# Altium schematic sheet WL-CPU-V1.0.SchDoc
size 594 x 420 mm; Address1: Address1; Address2: Address2; Address3: Address3; Address4: Address4; DocumentNumber: Wolf-Lite; SheetNumber: 2; Scale: 1:1; DocumentType: Схема электрическая принципиальная; FirstReferrence: UA3REO/R7KBI
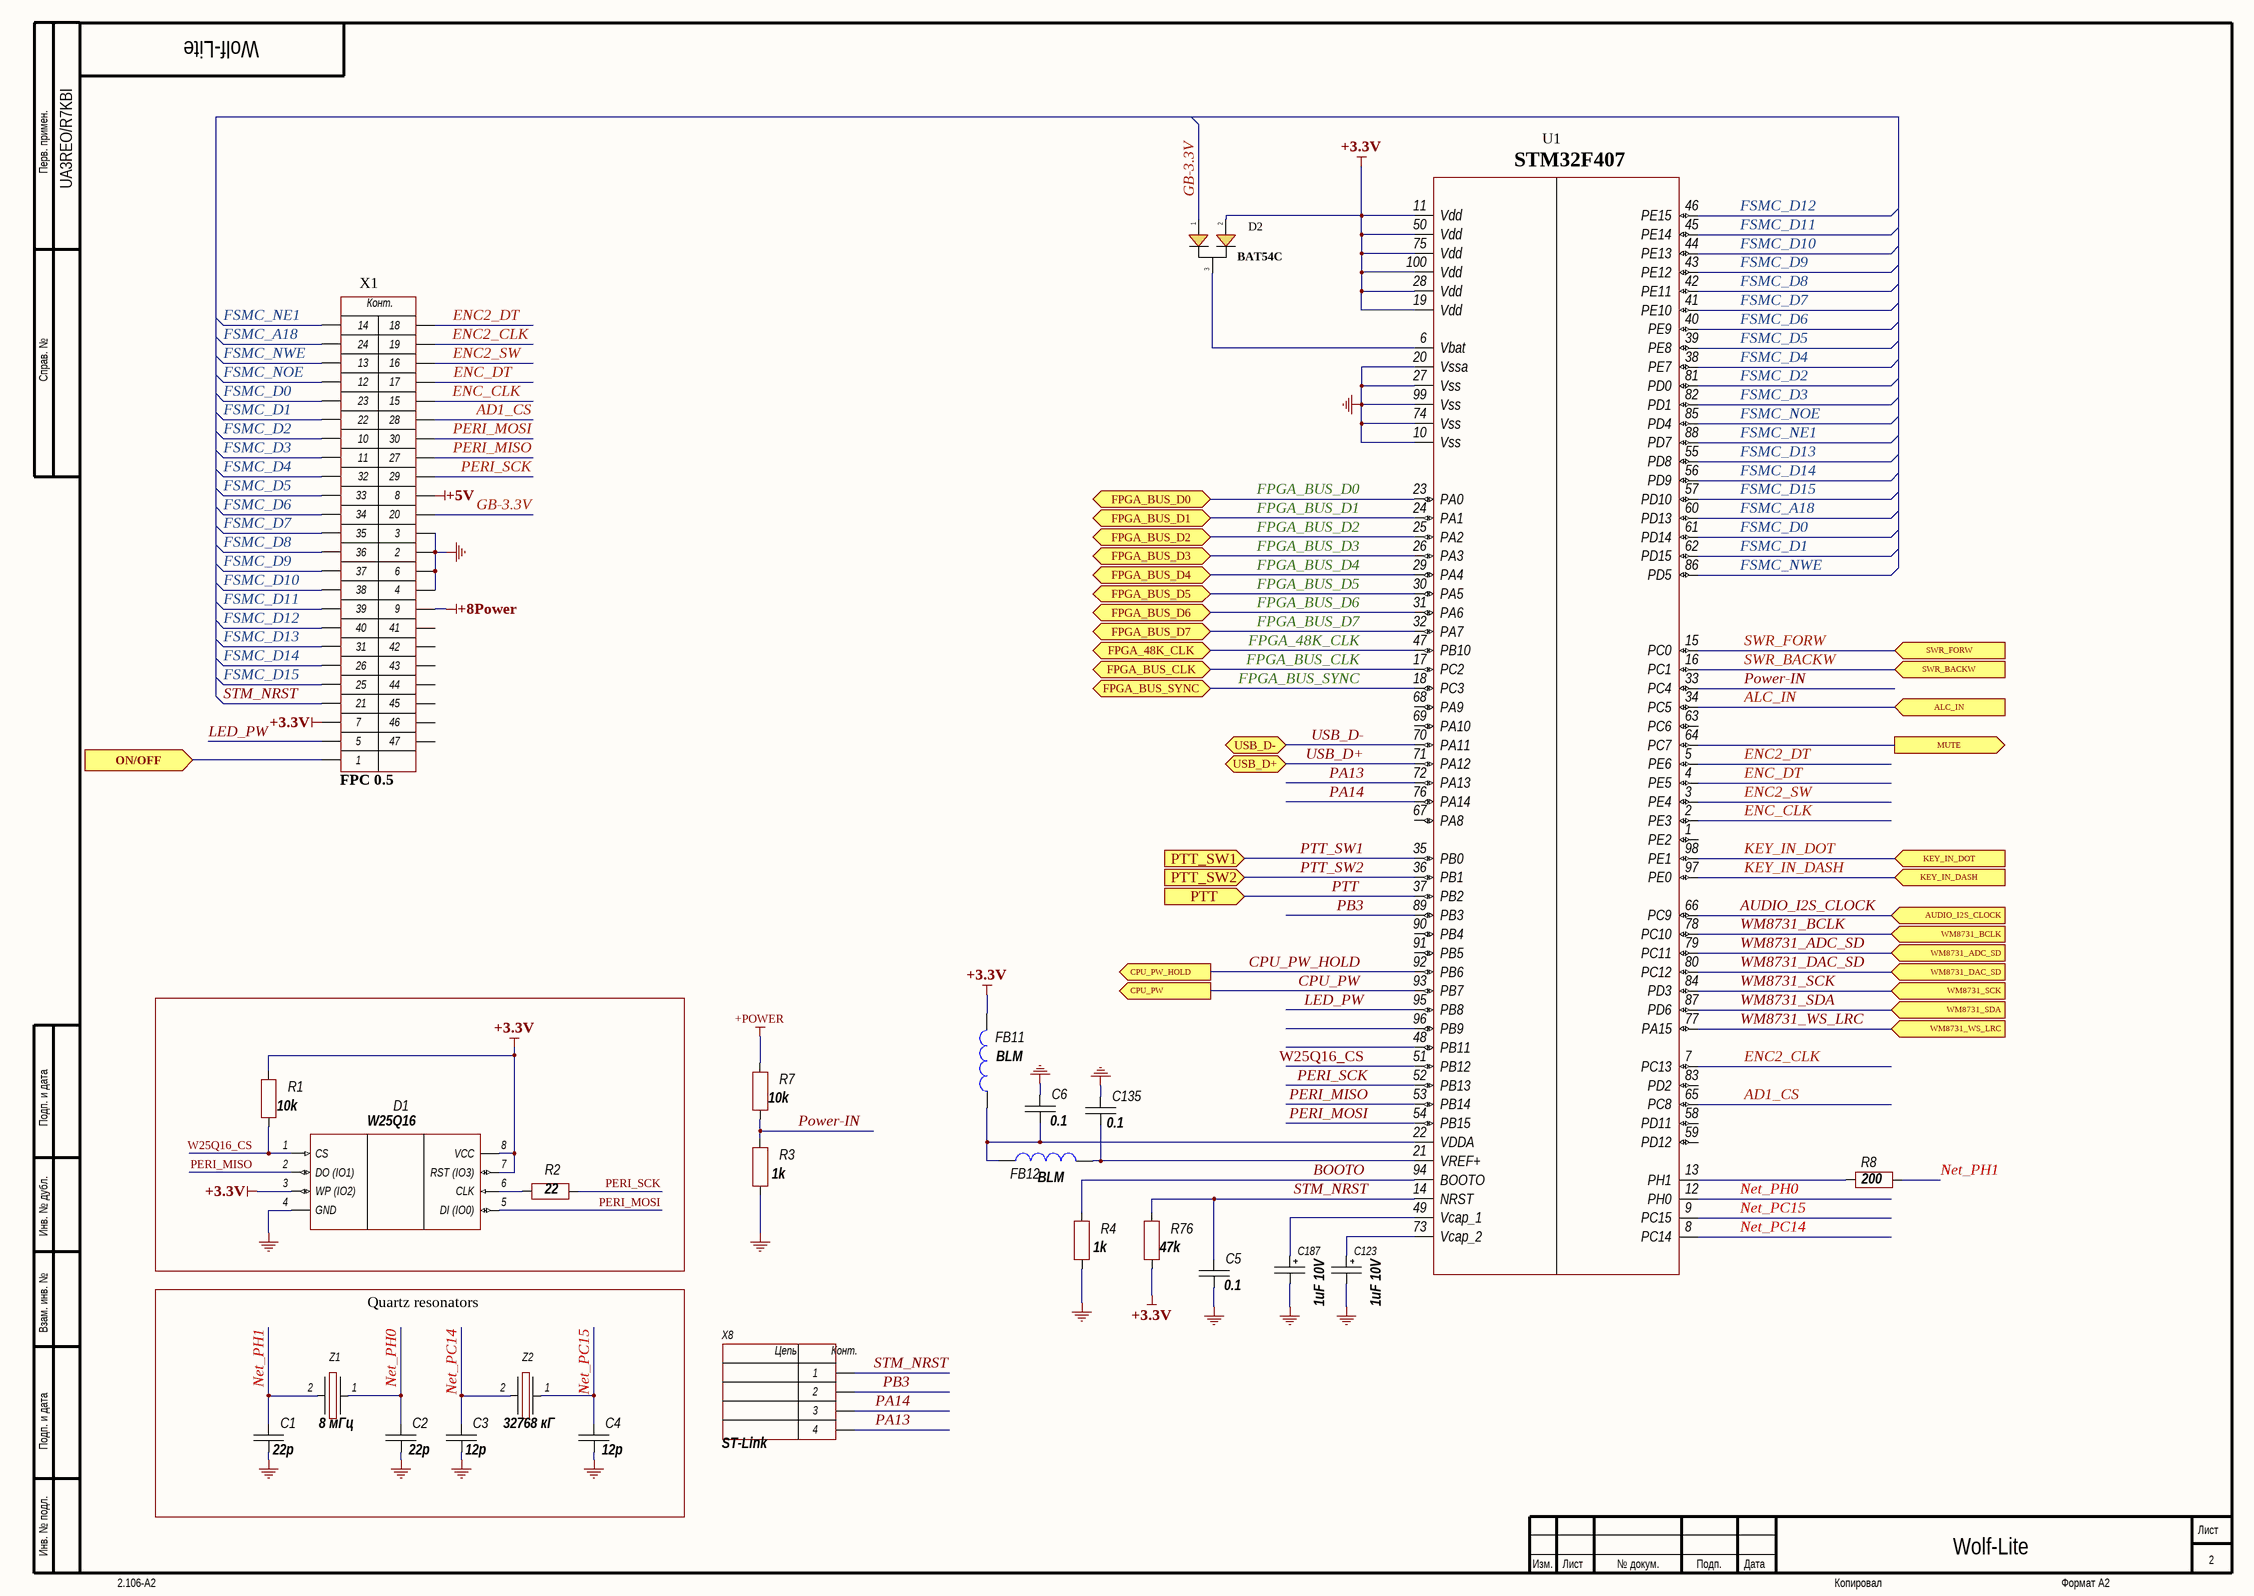
[diagram p0: WL-CPU-V1.0.SchDoc]

## Parts
C1  22p  [CH0805C]
C2  22p  [CH0805C]
C3  12p  [CH0805C]
C4  12p  [CH0805C]
C5  0.1  [CH0805C]
C6  0.1  [CH0805C]
C123  1uF 10V  [TANTAL_A]
C135  0.1  [CH0805C]
C187  1uF 10V  [TANTAL_A]
D1  W25Q16  [SOIC-8-1]
D2  BAT54C  [SOT23_132]
FB11  BLM  [CH0805L]
FB12  BLM  [CH0805L]
R1  10k  [CH0805R]
R2  22  [CH0805R]
R3  1k  [CH0805R]
R4  1k  [CH0805R]
R7  10k  [CH0805R]
R8  200  [CH0805R]
R76  47k  [CH0805R]
U1  STM32F407  [100-LQFP]
X1  FPC 0.5  [CON: PLD2X20]
X8  ST-Link  [CON: PLS-4]
Z1  8 мГц  [OSC-dip]
Z2  32768 кГ  [Qz]

## Blocks framed on the sheet
Quartz resonators: C1-C4 Z1 Z2

## Ports
ALC_IN (in), AUDIO_I2S_CLOCK (in), CPU_PW (out), CPU_PW_HOLD (out), FPGA_48K_CLK (bidir), FPGA_BUS_CLK (bidir), FPGA_BUS_D0 (bidir), FPGA_BUS_D1 (bidir), FPGA_BUS_D2 (bidir), FPGA_BUS_D3 (bidir), FPGA_BUS_D4 (bidir), FPGA_BUS_D5 (bidir), FPGA_BUS_D6 (bidir), FPGA_BUS_D7 (bidir), FPGA_BUS_SYNC (bidir), KEY_IN_DASH (in), KEY_IN_DOT (in), MUTE (out), ON/OFF (in), PTT (in), PTT_SW1 (in), PTT_SW2 (in), SWR_BACKW (in), SWR_FORW (in), USB_D+ (bidir), USB_D- (bidir), WM8731_ADC_SD (in), WM8731_BCLK (in), WM8731_DAC_SD (in), WM8731_SCK (in), WM8731_SDA (in), WM8731_WS_LRC (in)

## Nets
+3.3V: D1.3(WP_(IO2)) D1.7(RST_(IO3)) D1.8(VCC) D2.2 FB11.1 R1.2 R76.1 U1.11(Vdd) U1.19(Vdd) U1.28(Vdd) U1.50(Vdd) U1.75(Vdd) U1.100(Vdd) X1.7
+5V: X1.8
+8Power: X1.9
+POWER: R7.2
GND: C1.1 C2.1 C3.1 C4.1 C5.1 C6.2 C123.2 C135.2 C187.2 D1.4(GND) R3.1 R4.1 U1.10(Vss) U1.20(Vssa) U1.27(Vss) U1.74(Vss) U1.99(Vss) X1.2 X1.3 X1.4 X1.6
AD1_CS: U1.65(PC8) X1.28
ALC_IN: U1.34(PC5) ; port ALC_IN
AUDIO_I2S_CLOCK: U1.66(PC9) ; port AUDIO_I2S_CLOCK
BOOTO: R4.2 U1.94(BOOTO)
CPU_PW: U1.93(PB7) ; port CPU_PW
CPU_PW_HOLD: U1.92(PB6) ; port CPU_PW_HOLD
ENC2_CLK: U1.7(PC13) X1.19
ENC2_DT: U1.5(PE6) X1.18
ENC2_SW: U1.3(PE4) X1.16
ENC_CLK: U1.2(PE3) X1.15
ENC_DT: U1.4(PE5) X1.17
FPGA_48K_CLK: U1.47(PB10) ; port FPGA_48K_CLK
FPGA_BUS_CLK: U1.17(PC2) ; port FPGA_BUS_CLK
FPGA_BUS_D0: U1.23(PA0) ; port FPGA_BUS_D0
FPGA_BUS_D1: U1.24(PA1) ; port FPGA_BUS_D1
FPGA_BUS_D2: U1.25(PA2) ; port FPGA_BUS_D2
FPGA_BUS_D3: U1.26(PA3) ; port FPGA_BUS_D3
FPGA_BUS_D4: U1.29(PA4) ; port FPGA_BUS_D4
FPGA_BUS_D5: U1.30(PA5) ; port FPGA_BUS_D5
FPGA_BUS_D6: U1.31(PA6) ; port FPGA_BUS_D6
FPGA_BUS_D7: U1.32(PA7) ; port FPGA_BUS_D7
FPGA_BUS_SYNC: U1.18(PC3) ; port FPGA_BUS_SYNC
FSMC_A18: U1.60(PD13) X1.24
FSMC_D0: U1.61(PD14) X1.23
FSMC_D1: U1.62(PD15) X1.22
FSMC_D2: U1.81(PD0) X1.10
FSMC_D3: U1.82(PD1) X1.11
FSMC_D4: U1.38(PE7) X1.32
FSMC_D5: U1.39(PE8) X1.33
FSMC_D6: U1.40(PE9) X1.34
FSMC_D7: U1.41(PE10) X1.35
FSMC_D8: U1.42(PE11) X1.36
FSMC_D9: U1.43(PE12) X1.37
FSMC_D10: U1.44(PE13) X1.38
FSMC_D11: U1.45(PE14) X1.39
FSMC_D12: U1.46(PE15) X1.40
FSMC_D13: U1.55(PD8) X1.31
FSMC_D14: U1.56(PD9) X1.26
FSMC_D15: U1.57(PD10) X1.25
FSMC_NE1: U1.88(PD7) X1.14
FSMC_NOE: U1.85(PD4) X1.12
FSMC_NWE: U1.86(PD5) X1.13
GB-3.3V: D2.1 X1.20
KEY_IN_DASH: U1.97(PE0) ; port KEY_IN_DASH
KEY_IN_DOT: U1.98(PE1) ; port KEY_IN_DOT
LED_PW: U1.95(PB8) X1.5
MUTE: U1.64(PC7) ; port MUTE
Net_PC14: C3.2 U1.8(PC14) Z2.2
Net_PC15: C4.2 U1.9(PC15) Z2.1
Net_PH0: C2.2 U1.12(PH0) Z1.1
Net_PH1: C1.2 R8.1 Z1.2
ON/OFF: X1.1 ; port ON/OFF
PA13: U1.72(PA13) X8.4
PA14: U1.76(PA14) X8.3
PB3: U1.89(PB3) X8.2
PERI_MISO: D1.2(DO_(IO1)) U1.53(PB14) X1.27
PERI_MOSI: D1.5(DI_(IO0)) U1.54(PB15) X1.30
PERI_SCK: R2.2 U1.52(PB13) X1.29
Power-IN: R3.2 R7.1 U1.33(PC4)
PTT: U1.37(PB2) ; port PTT
PTT_SW1: U1.35(PB0) ; port PTT_SW1
PTT_SW2: U1.36(PB1) ; port PTT_SW2
STM_NRST: C5.2 R76.2 U1.14(NRST) X1.21 X8.1
SWR_BACKW: U1.16(PC1) ; port SWR_BACKW
SWR_FORW: U1.15(PC0) ; port SWR_FORW
USB_D+: U1.71(PA12) ; port USB_D+
USB_D-: U1.70(PA11) ; port USB_D-
W25Q16_CS: D1.1(CS) R1.1 U1.51(PB12)
WM8731_ADC_SD: U1.79(PC11) ; port WM8731_ADC_SD
WM8731_BCLK: U1.78(PC10) ; port WM8731_BCLK
WM8731_DAC_SD: U1.80(PC12) ; port WM8731_DAC_SD
WM8731_SCK: U1.84(PD3) ; port WM8731_SCK
WM8731_SDA: U1.87(PD6) ; port WM8731_SDA
WM8731_WS_LRC: U1.77(PA15) ; port WM8731_WS_LRC
NetC6_1: C6.1 FB11.2 FB12.2 U1.22(VDDA)
NetC123_1: C123.1 U1.73(Vcap_2)
NetC135_1: C135.1 FB12.1 U1.21(VREF+)
NetC187_1: C187.1 U1.49(Vcap_1)
NetD1_6: D1.6(CLK) R2.1
NetD2_3: D2.3 U1.6(Vbat)
NetR8_2: R8.2 U1.13(PH1)

Not connected (* = marked no-connect by the designer): U1 1(PE2) 48(PB11) 58(PD11) 59(PD12) 63(PC6) 67(PA8) 68(PA9) 69(PA10) 83(PD2) 90(PB4) 91(PB5) 96(PB9); X1 41 42 43 44 45 46 47

## Notes on the sheet
- Перв. примен.
- Справ. №
- Подп. и дата
- Инв. № дубл.
- Взам. инв. №
- Инв. № подл.
- Изм.
- Лист
- № докум.
- Подп.
- Дата
- 2.106-A2
- Копировал
- Формат А2
- (in symbol 4-Connector) Цепь; Конт.
- (in symbol FPC-45-0.5) Конт.

## Library data of the parts
C1-C6 C135 = Capacitor: Manufacturer: *; Model: *; HelpURL: *; ComponentKind: *; Value: *
C123 C187 = TantalCap: Manufacturer: *; Model: *; HelpURL: *; ComponentKind: *; Value: *
D1 = W25Q32JVZPIQ: Flash; Manufacturer: Winbond Electronics; Model: W25Q32JVZPIQ; HelpURL: https://www.digikey.com/product-detail/en/winbond-electronics/W25Q32JVZPIQ/W25Q32JVZPIQ-ND/6167525; ComponentKind: 8-WSON
FB11 FB12 = Inductor: Manufacturer: *; Model: *; HelpURL: *; ComponentKind: *; Value: *
R1-R4 R7 R8 R76 = Resistor: Manufacturer: *; Model: *; HelpURL: *; ComponentKind: *; Value: *
U1 = STM32F407-Wolf-lite
X1 = FPC-45-0.5: System: Connector
X8 = 4-Connector: Model: *; Manufacturer: *; HelpURL: *; ComponentKind: *
Z1 Z2 = Oscillator: Manufacturer: *; Model: *; HelpURL: *; ComponentKind: *; Value: *